# EAGLE design test (EAGLE 7.5.0)
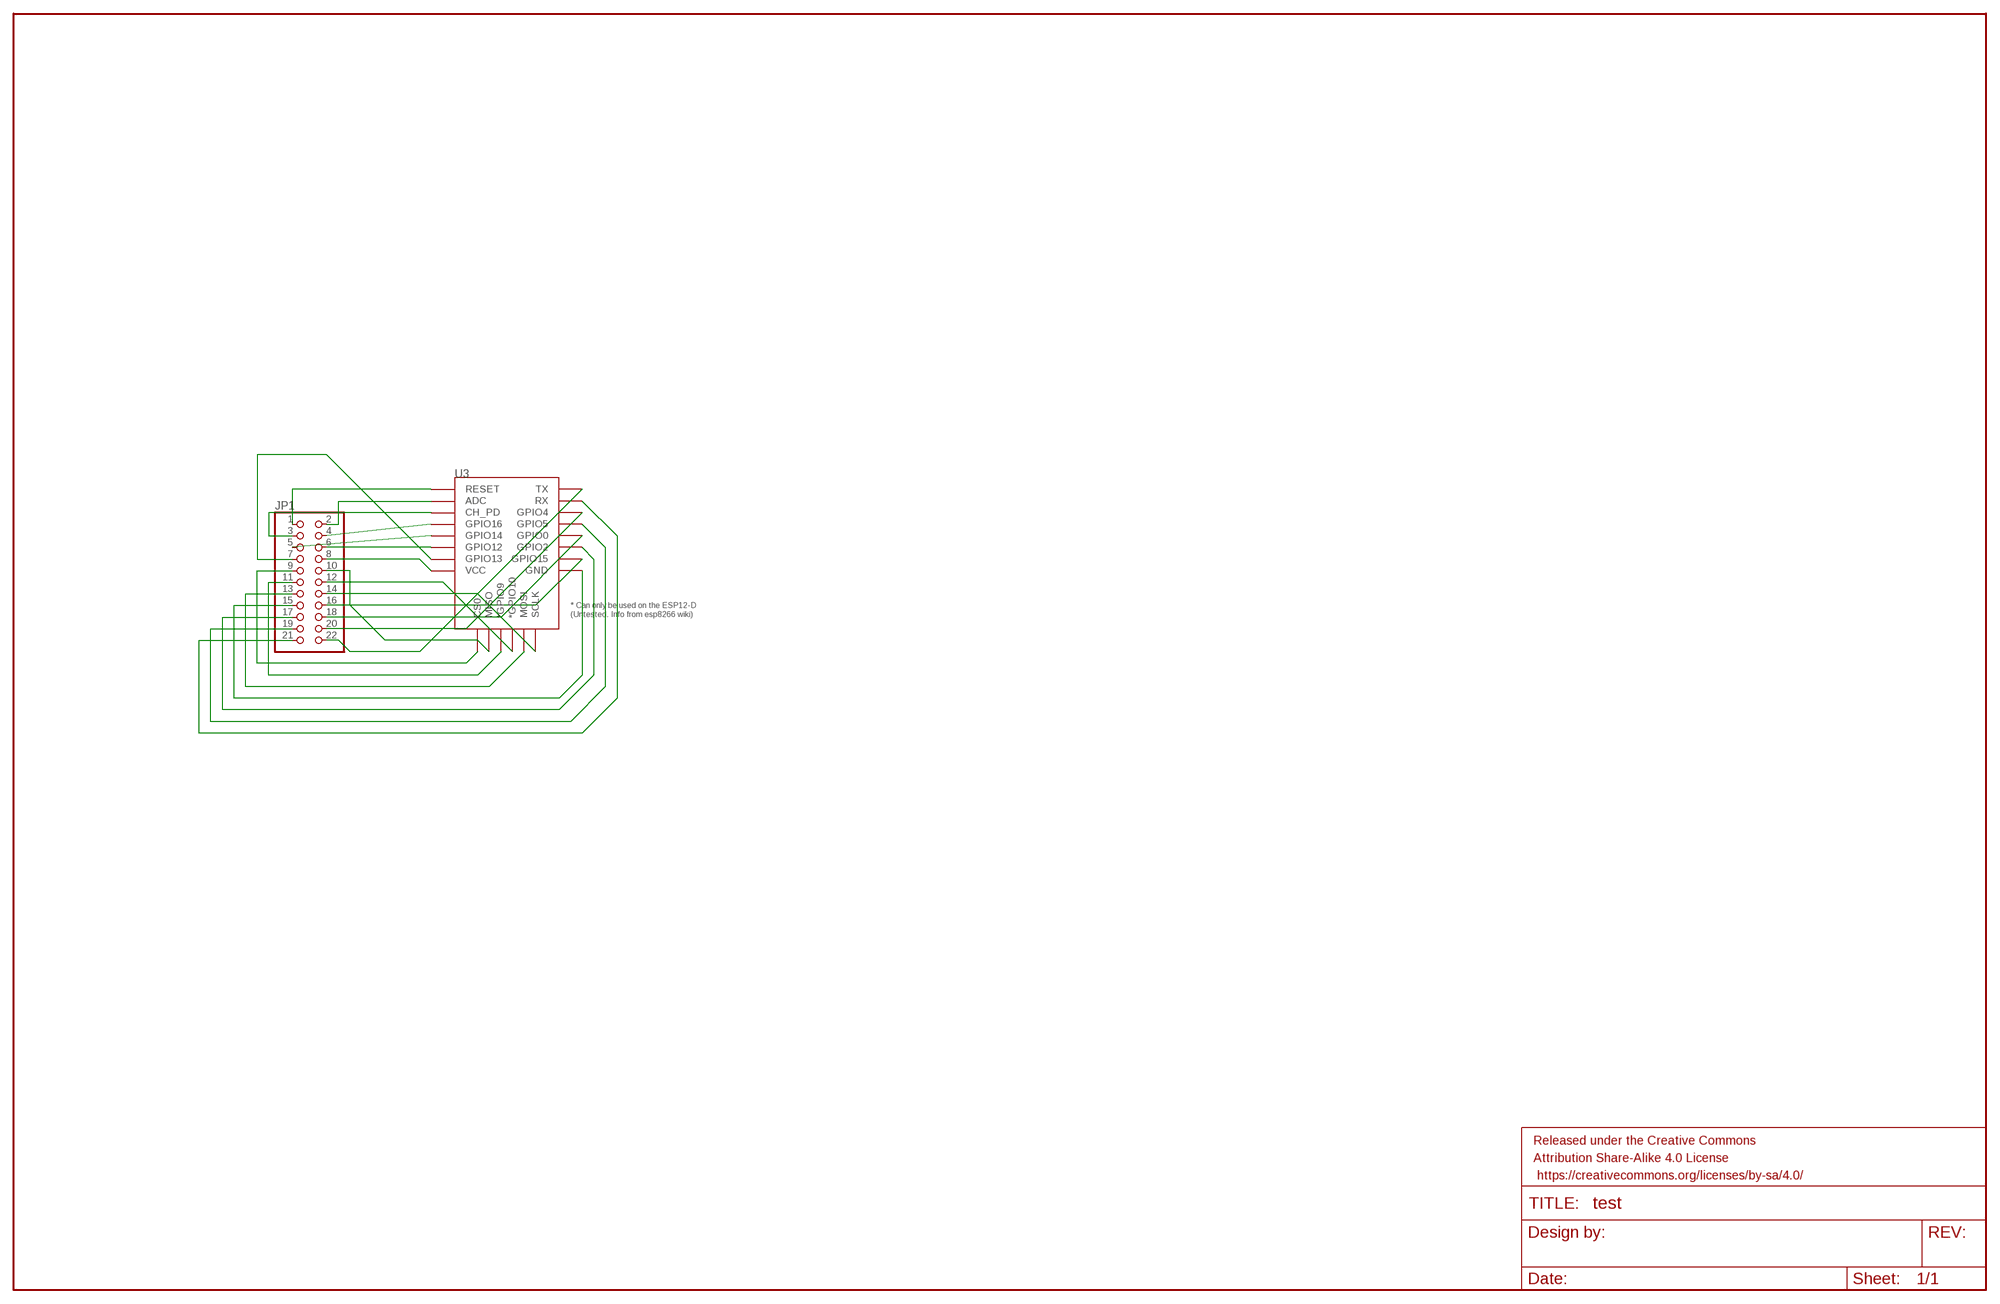
[diagram p0: schematic, sheet 1]

## Parts
FRAME1  FRAME-LEDGER  [CREATIVE_COMMONS]
JP1  PINHD-2X11/90  [2X11/90]
U3  ESP12ESMD  [ESP12E-SMD]

## Nets
N$1: JP1.1 U3.RESET
N$2: JP1.2 U3.ADC
N$3: JP1.3 U3.CH_PD
N$4: JP1.4 U3.GPIO16
N$5: JP1.5 U3.GPIO14
N$6: JP1.6 U3.GPIO12
N$7: JP1.7 U3.GPIO13
N$8: JP1.8 U3.VCC
N$9: JP1.9 U3.CS0
N$10: JP1.10 U3.MISO
N$11: JP1.11 U3.GPIO9(*GPIO9)
N$12: JP1.12 U3.GPIO10(*GPIO10)
N$13: JP1.13 U3.MOSI
N$14: JP1.14 U3.SCLK
N$15: JP1.15 U3.GND
N$16: JP1.16 U3.GPIO15
N$17: JP1.17 U3.GPIO2
N$18: JP1.18 U3.GPIO0
N$19: JP1.19 U3.GPIO5
N$20: JP1.20 U3.GPIO4
N$21: JP1.21 U3.RXD0(RX)
N$22: JP1.22 U3.TXD0(TX)

## Library data of the parts
FRAME1 = SparkFun-Aesthetics:FRAME-LEDGER: Schematic Frame Standard 11x14 US Ledger frame
JP1 = pinhead:PINHD-2X11: PIN HEADER
U3 = esp8266modules:ESP12E: ESP12E Module

## Board
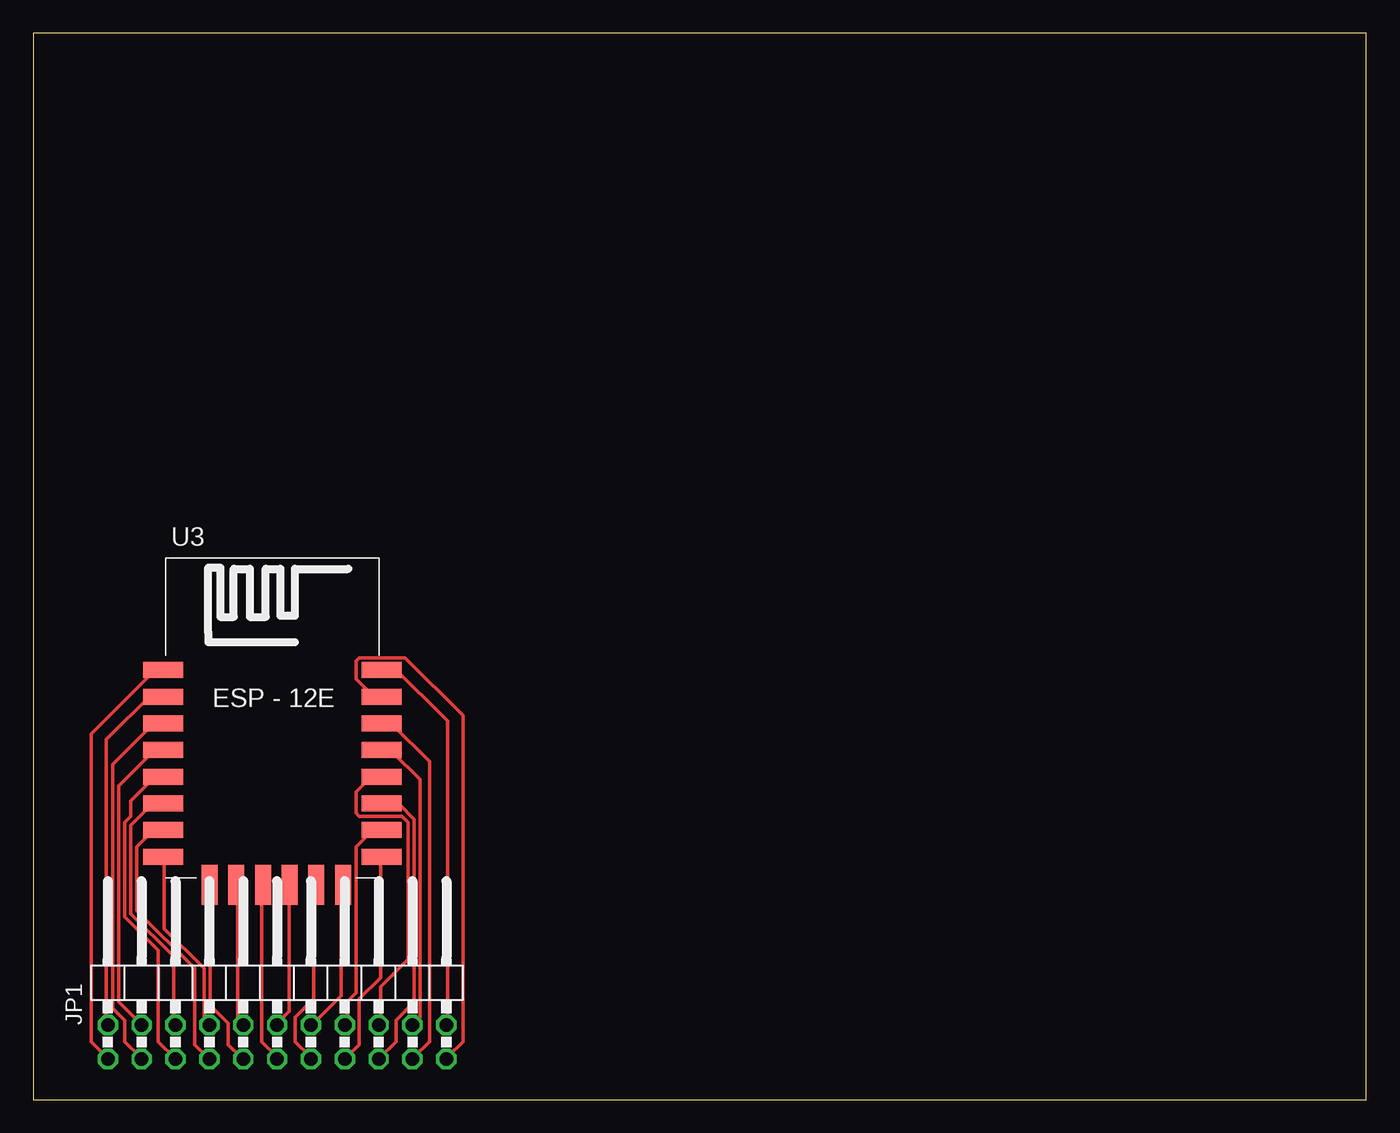
[diagram p1: board, top side]

Size 100 x 80 mm. Coordinates in mm from the lower left corner, seen from the top.
Outline: 0,0 100,0 100,80 0,80 0,0
Copper layers (1*16): Top 0.035mm / dielectric 1.5mm / Bottom 0.035mm
Design rules "default": minimum track width 10mil, minimum drill 24mil, track to track 8mil, track to pad 8mil, pad to pad 8mil, via to via 8mil, smd to smd 8mil, copper to edge 40mil, drill to drill 8mil, minimum pad ring 10mil, minimum via ring 8mil, stop-mask expansion 4mil, vias tented up to drill 0mil, thermal gap 10mil

### Footprints (pad centres in the part's own frame; a part is rotated, then mirrored left to right if it is on the bottom)
2X11/90 = drill 1.016 octagon: 1 -12.7,-6.35; 2 -12.7,-3.81; 3 -10.16,-6.35; 4 -10.16,-3.81; 5 -7.62,-6.35; 6 -7.62,-3.81; 7 -5.08,-6.35; 8 -5.08,-3.81; 9 -2.54,-6.35; 10 -2.54,-3.81; 11 0,-6.35; 12 0,-3.81; 13 2.54,-6.35; 14 2.54,-3.81; 15 5.08,-6.35; 16 5.08,-3.81; 17 7.62,-6.35; 18 7.62,-3.81; 19 10.16,-6.35; 20 10.16,-3.81; 21 12.7,-6.35; 22 12.7,-3.81
ESP12E-SMD = smd 3 x 1.2: ADC -8.3,3.8; CH_PD -8.3,1.8; GND 8.1,-8.2; GPIO0 8.1,-2.2; GPIO2 8.1,-4.2; GPIO4 8.1,-0.2; GPIO5 8.1,1.8; GPIO12 -8.3,-4.2; GPIO13 -8.3,-6.2; GPIO14 -8.3,-2.2; GPIO15 8.1,-6.2; GPIO16 -8.3,-0.2; RESET -8.3,5.8; RXD0 8.1,3.8; TXD0 8.1,5.8; VCC -8.3,-8.2 | smd 1.2 x 3: CS0 -4.8,-10.3; GPIO9 -0.8,-10.3; GPIO10 1.2,-10.3; MISO -2.8,-10.3; MOSI 3.2,-10.3; SCLK 5.2,-10.3

### Placement (x,y rotation side)
FRAME1  -101.6,46.99 0 top  (outside the outline)
JP1  18.29,9.4 0 top
U3  18.03,26.42 0 top

### Tracks (layer width: path | path; a pad name or v marks a point on that pad's centre or on a via)
N$1
  Top 0.254: U3.RESET 9.6,32 8.91,32 4.34,27.43 4.34,4.34 5.49,3.2 JP1.1
N$2
  Top 0.254: U3.ADC 9.6,30.18 8.91,30.43 5.49,27 5.49,5.71 JP1.2
N$3
  Top 0.254: U3.CH_PD 9.6,28.12 8.91,28.12 5.94,25.15 5.94,6.86 6.86,5.94 6.86,4.34 8,3.2 JP1.3
N$4
  Top 0.254: JP1.4 6.4,7.32 6.4,23.55 8.91,26.06 9.6,26.06 U3.GPIO16
N$5
  Top 0.254: JP1.5 9.37,4.34 9.37,11.2 6.86,13.72 6.86,20.8 7.32,21.26 7.32,22.4 8.91,24 9.6,24 U3.GPIO14
N$6
  Top 0.254: U3.GPIO12 9.6,22.17 8.91,22.17 7.32,20.57 7.32,13.95 10.52,10.74 10.52,5.71 JP1.6
N$7
  Top 0.254: U3.GPIO13 9.6,20.12 8.91,20.12 7.77,18.97 7.77,14.17 12.12,9.83 12.12,4.12 13.03,3.2 JP1.7
N$8
  Top 0.254: U3.VCC 9.83,18.06 9.83,12.8 12.8,9.83 12.8,5.94 13.03,5.71 JP1.8
N$9
  Top 0.254: U3.CS0 13.26,16 13.26,7.09 14.63,5.71 14.63,4.12 15.54,3.2 JP1.9
N$10
  Top 0.254: U3.MISO 15.32,16 15.32,5.94 15.54,5.71 JP1.10
N$11
  Top 0.254: U3.GPIO9 17.14,16 17.14,4.34 18.29,3.2 JP1.11
N$12
  Top 0.254: U3.GPIO10 19.2,16 19.2,6.63 18.29,5.71 JP1.12
N$13
  Top 0.254: U3.MOSI 21.03,16 21.03,7.54 19.66,6.17 19.66,4.34 20.8,3.2 JP1.13
N$14
  Top 0.254: U3.SCLK 23.09,16 23.09,7.77 21.03,5.71 JP1.14
N$15
  Top 0.254: U3.GND 26.06,18.06 26.06,9.14 24.46,7.54 24.46,4.12 23.55,3.2 JP1.15
N$16
  Top 0.254: U3.GPIO15 26.06,20.12 25.38,20.12 24.23,18.97 24.23,8 23.55,7.32 23.55,5.71 JP1.16
N$17
  Top 0.254: JP1.17 27.2,4.34 27.2,5.94 28.57,7.32 28.57,21.03 27.43,22.17 26.29,22.17 U3.GPIO2
N$18
  Top 0.254: U3.GPIO0 26.06,24 25.15,24 24.23,23.09 24.23,21.49 24.46,21.26 27.66,21.26 28.12,20.8 28.12,10.52 26.06,8.46 26.06,5.71 JP1.18
N$19
  Top 0.254: U3.GPIO5 26.29,28.12 26.98,28.12 29.72,25.38 29.72,4.34 28.57,3.2 JP1.19
N$20
  Top 0.254: JP1.20 29.03,6.17 29.03,24 26.98,26.06 26.29,26.06 U3.GPIO4
N$21
  Top 0.254: U3.RXD0 26.06,30.4 25.38,30.4 24.23,31.55 24.23,32.92 24.46,33.15 27.89,33.15 32.23,28.8 32.23,4.34 31.09,3.2 JP1.21
N$22
  Top 0.254: U3.TXD0 26.29,32 26.98,32.51 31.09,28.4 31.09,5.71 JP1.22